# Altium project AD835乘法器.PrjPcb
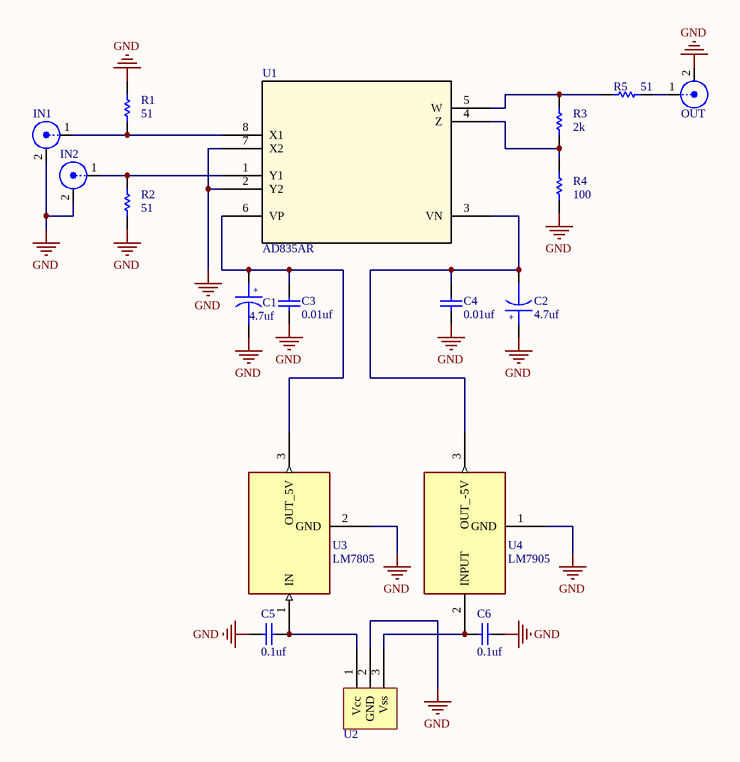
[diagram p0: AD835乘法器.SchDoc]
1 sheet, 18 parts. Net scope: global (net labels, ports and power ports of the same name join across sheets).
Board file: AD835乘法器.PcbDoc

## Sheet AD835乘法器.SchDoc
size A4

### Parts
C1  4.7uf  [7343C-TYPE_D]
C2  4.7uf  [7343C-TYPE_D]
C3  0.01uF  [0805]
C4  值: 0.01uf  [0805]  (hidden comment: Cap1)
C5  值: 0.1uf  [0805]  (hidden comment: Cap1)
C6  值: 0.1uf  [0805]  (hidden comment: Cap1)
IN1  SMA-2  [SMA-2]  (value not drawn)
IN2  SMA-2  [SMA-2]  (value not drawn)
OUT  SMA-2  [SMA-2]  (value not drawn)
R1  值: 51  [0805]  (hidden comment: RES)
R2  值: 51  [0805]  (hidden comment: RES)
R3  值: 2k  [0805]  (hidden comment: RES)
R4  值: 100  [0805]  (hidden comment: RES)
R5  值: 51  [0805]  (hidden comment: RES)
U1  AD835AR  [R_8]
U2  XH2.54-3p  [XH2.54-3p]  (value not drawn)
U3  LM7805  [TO-220]
U4  LM7905  [TO-220]

### Nets
GND: C1.2 C2.1 C3.1 C4.1 C5.1 C6.1 IN1.2(GND) IN2.2(GND) OUT.2(GND) R1.2 R2.1 R4.1 U1.2(Y2) U1.7(X2) U2.2(GND) U3.2(GND) U4.1(GND)
NetC1_1: C1.1 C3.2 U1.6(VP) U3.3(OUT_5V)
NetC2_2: C2.2 C4.2 U1.3(VN) U4.3(OUT_-5V)
NetC5_2: C5.2 U2.1(Vcc) U3.1(IN)
NetC6_2: C6.2 U2.3(Vss) U4.2(INPUT)
NetIN1_1: IN1.1(Signal) R1.1 U1.8(X1)
NetIN2_1: IN2.1(Signal) R2.2 U1.1(Y1)
NetOUT_1: OUT.1(Signal) R5.2
NetR3_1: R3.1 R4.2 U1.4(Z)
NetR3_2: R3.2 R5.1 U1.5(W)

### Notes on the sheet
- (in symbol Cap) +

### Library data of the parts
C1 C2 = Cap
C3 = Cap1: 值: 0.01uf
U1 = AD835AR: Imported; Manufacturer_Part_Number: AD835AR; Vendor: Vendor; Value: Value; Type: Type; RefDes: Refdes